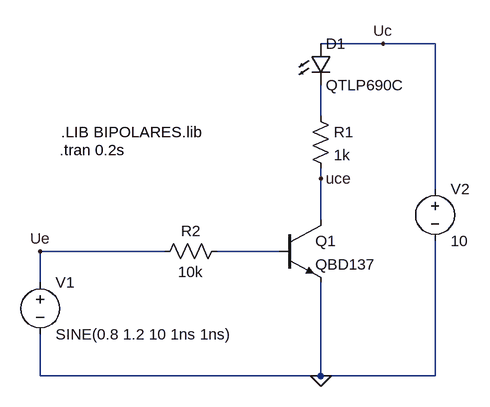
[diagram p0: schematic Draft1.asc]
Draft1.asc, the LTspice schematic file:
Version 4
SHEET 1 880 680
WIRE 272 32 176 32
WIRE 352 32 272 32
WIRE 176 144 176 96
WIRE 176 240 176 224
WIRE 352 256 352 32
WIRE 176 304 176 240
WIRE -64 352 -256 352
WIRE 112 352 16 352
WIRE -256 400 -256 352
WIRE -256 544 -256 480
WIRE 176 544 176 400
WIRE 176 544 -256 544
WIRE 352 544 352 336
WIRE 352 544 176 544
FLAG 176 544 0
FLAG 272 32 Uc
FLAG -256 352 Ue
FLAG 176 240 uce
SYMBOL LED 160 32 R0
SYMATTR InstName D1
SYMATTR Value QTLP690C
SYMBOL res 160 128 R0
SYMATTR InstName R1
SYMATTR Value 1k
SYMBOL npn 112 304 R0
SYMATTR InstName Q1
SYMATTR Value QBD137
SYMBOL res 32 336 R90
WINDOW 0 0 56 VBottom 2
WINDOW 3 32 56 VTop 2
SYMATTR InstName R2
SYMATTR Value 10k
SYMBOL voltage -256 384 R0
WINDOW 123 0 0 Left 0
WINDOW 39 0 0 Left 0
SYMATTR InstName V1
SYMATTR Value SINE(0.8 1.2 10 1ns 1ns)
SYMBOL voltage 352 240 R0
WINDOW 123 0 0 Left 0
WINDOW 39 0 0 Left 0
SYMATTR InstName V2
SYMATTR Value 10
TEXT -224 168 Left 2 !.LIB BIPOLARES.lib
TEXT -226 196 Left 2 !.tran 0.2s

The netlist it stands for:
* Draft1.asc
D1 Uc N001 QTLP690C
R1 N001 uce 1k
Q1 uce N002 0 0 QBD137
R2 N002 Ue 10k
V1 Ue 0 SINE(0.8 1.2 10 1ns 1ns)
V2 Uc 0 10
.model D D
.lib standard.dio
.model NPN NPN
.model PNP PNP
.lib standard.bjt
.LIB BIPOLARES.lib
.tran 0.2s
.backanno
.end